# EAGLE design prox_module (EAGLE 6.3)
Proximity Module -- manages data from 8 external bumpers and 3 ultrasonic sensors. All bumper inputs are sent through a low-pass filter (0.1uF cap) and a schmitt trigger/inverter to smooth the signals. This module is a 5V system that uses a custom level converter for the SDA and SCL lines to make the 5V system work with the 3.3V systems. The ultrasonic sensors are connected directly to a digital pin. All power in this system is smoothed for low-pass and high-pass noise.
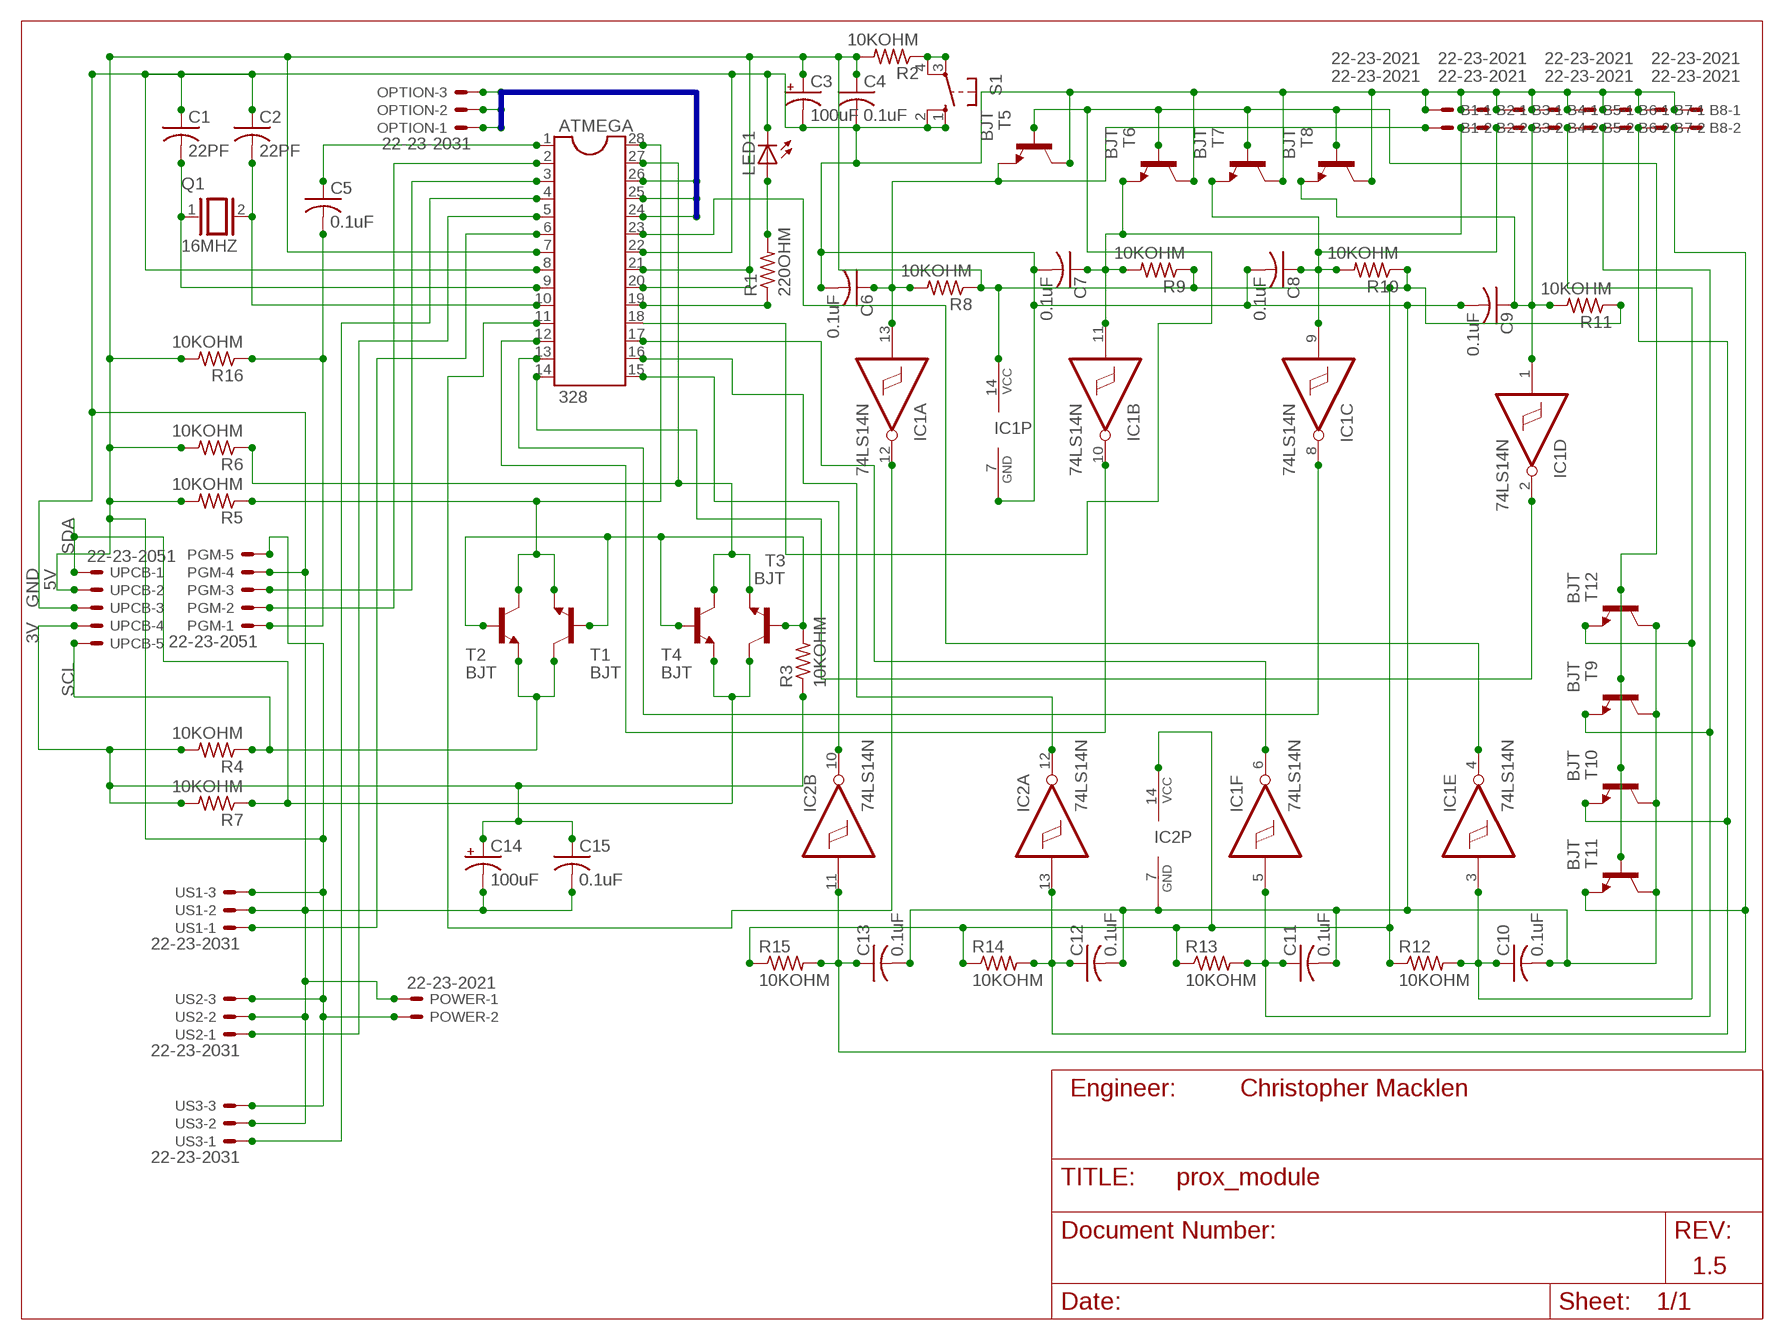
[diagram p0: schematic, sheet 1]

## Parts
ATMEGA  328  DIL28  [DIL28-6]
B1  22-23-2021  [22-23-2021]
B2  22-23-2021  [22-23-2021]
B3  22-23-2021  [22-23-2021]
B4  22-23-2021  [22-23-2021]
B5  22-23-2021  [22-23-2021]
B6  22-23-2021  [22-23-2021]
B7  22-23-2021  [22-23-2021]
B8  22-23-2021  [22-23-2021]
C1  22PF  C-US025-024X044  [C025-024X044]
C2  22PF  C-US025-024X044  [C025-024X044]
C3  100uF  CPOL-USE2-5  [E2-5]
C4  0.1uF  C-US025-024X044  [C025-024X044]
C5  0.1uF  C-US025-024X044  [C025-024X044]
C6  0.1uF  C-US025-024X044  [C025-024X044]
C7  0.1uF  C-US025-024X044  [C025-024X044]
C8  0.1uF  C-US025-024X044  [C025-024X044]
C9  0.1uF  C-US025-024X044  [C025-024X044]
C10  0.1uF  C-US025-024X044  [C025-024X044]
C11  0.1uF  C-US025-024X044  [C025-024X044]
C12  0.1uF  C-US025-024X044  [C025-024X044]
C13  0.1uF  C-US025-024X044  [C025-024X044]
C14  100uF  CPOL-USE2-5  [E2-5]
C15  0.1uF  C-US025-024X044  [C025-024X044]
IC1  74LS14N  [DIL14]
IC2  74LS14N  [DIL14]
LED1  LED3MM  [LED3MM]
OPTION  22-23-2031  [22-23-2031]
PGM  22-23-2051  [22-23-2051]
POWER  22-23-2021  [22-23-2021]
Q1  16MHZ  XTAL/S  [QS]
R1  220OHM  R-US_0204/7  [0204/7]
R2  10KOHM  R-US_0204/7  [0204/7]
R3  10KOHM  R-US_0204/7  [0204/7]
R4  10KOHM  R-US_0204/7  [0204/7]
R5  10KOHM  R-US_0204/7  [0204/7]
R6  10KOHM  R-US_0204/7  [0204/7]
R7  10KOHM  R-US_0204/7  [0204/7]
R8  10KOHM  R-US_0204/7  [0204/7]
R9  10KOHM  R-US_0204/7  [0204/7]
R10  10KOHM  R-US_0204/7  [0204/7]
R11  10KOHM  R-US_0204/7  [0204/7]
R12  10KOHM  R-US_0204/7  [0204/7]
R13  10KOHM  R-US_0204/7  [0204/7]
R14  10KOHM  R-US_0204/7  [0204/7]
R15  10KOHM  R-US_0204/7  [0204/7]
R16  10KOHM  R-US_0204/7  [0204/7]
S1  10-XX  [B3F-10XX]
T1  BJT  -NPN-TO92-E1  [TO92-E1]
T2  BJT  -NPN-TO92-E1  [TO92-E1]
T3  BJT  -NPN-TO92-E1  [TO92-E1]
T4  BJT  -NPN-TO92-E1  [TO92-E1]
T5  BJT  -NPN-TO92-E1  [TO92-E1]
T6  BJT  -NPN-TO92-E1  [TO92-E1]
T7  BJT  -NPN-TO92-E1  [TO92-E1]
T8  BJT  -NPN-TO92-E1  [TO92-E1]
T9  BJT  -NPN-TO92-E1  [TO92-E1]
T10  BJT  -NPN-TO92-E1  [TO92-E1]
T11  BJT  -NPN-TO92-E1  [TO92-E1]
T12  BJT  -NPN-TO92-E1  [TO92-E1]
UPCB  22-23-2051  [22-23-2051]
US1  22-23-2031  [22-23-2031]
US2  22-23-2031  [22-23-2031]
US3  22-23-2031  [22-23-2031]

## Nets
3V: C14.+ C15.1 R3.1 R4.2 R7.2 UPCB.4
5V: ATMEGA.7 ATMEGA.20 ATMEGA.21 C3.+ C4.1 IC1.14(P:VCC) IC2.14(P:VCC) PGM.5 POWER.2 R2.2 R5.2 R6.2 R8.1 R9.1 R10.1 R11.1 R12.1 R13.1 R14.1 R15.1 R16.2 UPCB.2 US1.3 US2.3 US3.3
BMP-IN1: B1.2 C6.1 IC1.13(A:I) R8.2 T5.3(E)
BMP-IN2: B2.2 C7.1 IC1.11(B:I) R9.2 T6.3(E)
BMP-IN3: B3.2 C8.1 IC1.9(C:I) R10.2 T7.3(E)
BMP-IN4: B4.2 C9.1 IC1.1(D:I) R11.2 T8.3(E)
BMP-IN5: B5.2 C10.1 IC1.3(E:I) R12.2 T12.3(E)
BMP-IN6: B6.2 C11.1 IC1.5(F:I) R13.2 T9.3(E)
BMP-IN7: B7.2 C12.1 IC2.13(A:I) R14.2 T10.3(E)
BMP-IN8: B8.2 C13.1 IC2.11(B:I) R15.2 T11.3(E)
BMP-OUT1: ATMEGA.11 IC1.12(A:O)
BMP-OUT2: ATMEGA.12 IC1.10(B:O)
BMP-OUT3: ATMEGA.13 IC1.8(C:O)
BMP-OUT4: ATMEGA.14 IC1.2(D:O)
BMP-OUT5: ATMEGA.15 IC2.10(B:O)
BMP-OUT6: ATMEGA.16 IC2.12(A:O)
BMP-OUT7: ATMEGA.17 IC1.6(F:O)
BMP-OUT8: ATMEGA.23 IC1.4(E:O)
CLK-1: ATMEGA.9 C1.2 Q1.1
CLK-2: ATMEGA.10 C2.2 Q1.2
GND: ATMEGA.8 ATMEGA.22 B1.1 B2.1 B3.1 B4.1 B5.1 B6.1 B7.1 B8.1 C1.1 C2.1 C3.- C4.2 C6.2 C7.2 C8.2 C9.2 C10.2 C11.2 C12.2 C13.2 C14.- C15.2 IC1.7(P:GND) IC2.7(P:GND) LED1.K(C) PGM.4 POWER.1 S1.1(S) S1.2(S1) T5.1(C) T6.1(C) T7.1(C) T8.1(C) T9.1(C) T10.1(C) T11.1(C) T12.1(C) UPCB.3 US1.2 US2.2 US3.2
I2C-EN: R3.2 T1.2(B) T2.2(B) T3.2(B) T4.2(B)
LEDNET-1: ATMEGA.19 R1.1
LEDNET-2: LED1.A R1.2
OPTION1: ATMEGA.24 OPTION.1
OPTION2: ATMEGA.25 OPTION.2
OPTION3: ATMEGA.26 OPTION.3
RST-1: C5.2 PGM.1 R16.1
RST-2: ATMEGA.1 C5.1
RST-SW: R2.1 S1.3(P) S1.4(P1)
RX-TX: ATMEGA.3 PGM.3
SCL: R4.1 T1.1(C) T2.3(E) UPCB.5
SCL-5V: ATMEGA.28 R5.1 T1.3(E) T2.1(C)
SDA: R7.1 T3.1(C) T4.3(E) UPCB.1
SDA-5V: ATMEGA.27 R6.1 T3.3(E) T4.1(C)
TEST: ATMEGA.18 T5.2(B) T6.2(B) T7.2(B) T8.2(B) T9.2(B) T10.2(B) T11.2(B) T12.2(B)
TX-RX: ATMEGA.2 PGM.2
US1DATA: ATMEGA.6 US1.1
US2DATA: ATMEGA.5 US2.1
US3DATA: ATMEGA.4 US3.1
Unconnected: IC2.1(D:I) IC2.2(D:O) IC2.3(E:I) IC2.4(E:O) IC2.5(F:I) IC2.6(F:O) IC2.8(C:O) IC2.9(C:I)

## Buses
OPTION[1..3]

## Notes on the sheet
- Engineer: | Christopher Macklen
- 1.5

## Library data of the parts
ATMEGA = ic-package:DIL28: Dual In Line
B1-B8 POWER = con-molex:22-23-2021: .100" (2.54mm) Center Header - 2 Pin; MF: MOLEX; MPN: 22-23-2021; OC_FARNELL: 1462926; OC_NEWARK: 25C3832
C1 C2 C4-C13 C15 = rcl:C-US: CAPACITOR, American symbol
C3 C14 = rcl:CPOL-US: POLARIZED CAPACITOR, American symbol
IC1 IC2 = 74xx-us:74*14: Hex schmitt trigger INVERTER
LED1 = led:LED: LED OSRAM: - CHIPLED LG R971, LG N971, LY N971, LG Q971, LY Q971, LO R971, LY R971 LH N974, LH R974 LS Q976, LO Q976, LY Q976 LO Q996 - Hyper CHIPLED LW Q18S LB Q993, LB Q99A, LB R99A - SideLED LS A670, LO A670, LY A670, LG A670, LP A670 LB A673, LV A673, LT A673, LW A673 LH A674 LY A675 LS A676, LA A676, LO A676, LY A676, LW A676 LS A679, LY A679, LG A679 - Hyper Micro SIDELED® LS Y876, LA Y876, LO Y876, LY Y876 LT Y87S - SmartLED LW L88C, LW L88S LB L89C, LB L89S, LG L890 LS L89K, LO L89K, LY L89K LS L896, LA L896, LO L896, LY L896 - TOPLED LS T670, LO T670, LY T670, LG T670, LP T670 LSG T670, LSP T670, LSY T670, LOP T670, LYG T670 LG T671, LOG T671, LSG T671 LB T673, LV T673, LT T673, LW T673 LH T674 LS T676, LA T676, LO T676, LY T676, LB T676, LH T676, LSB T676, LW T676 LB T67C, LV T67C, LT T67C, LS T67K, LO T67K, LY T67K, LW E67C LS E67B, LA E67B, LO E67B, LY E67B, LB E67C, LV E67C, LT E67C LW T67C LS T679, LY T679, LG T679 LS T770, LO T770, LY T770, LG T770, LP T770 LB T773, LV T773, LT T773, LW T773 LH T774 LS E675, LA E675, LY E675, LS T675 LS T776, LA T776, LO T776, LY T776, LB T776 LHGB T686 LT T68C, LB T68C - Hyper Mini TOPLED® LB M676 - Mini TOPLED Santana® LG M470 LS M47K, LO M47K, LY M47K Source: http://www.osram.convergy.de LUXEON: - LUMILED® LXK2-PW12-R00, LXK2-PW12-S00, LXK2-PW14-U00, LXK2-PW14-V00 LXK2-PM12-R00, LXK2-PM12-S00, LXK2-PM14-U00 LXK2-PE12-Q00, LXK2-PE12-R00, LXK2-PE12-S00, LXK2-PE14-T00, LXK2-PE14-U00 LXK2-PB12-K00, LXK2-PB12-L00, LXK2-PB12-M00, LXK2-PB14-N00, LXK2-PB14-P00, LXK2-PB14-Q00 LXK2-PR12-L00, LXK2-PR12-M00, LXK2-PR14-Q00, LXK2-PR14-R00 LXK2-PD12-Q00, LXK2-PD12-R00, LXK2-PD12-S00 LXK2-PH12-R00, LXK2-PH12-S00 LXK2-PL12-P00, LXK2-PL12-Q00, LXK2-PL12-R00 Source: www.luxeon.com KINGBRIGHT: KA-3528ASYC Source: www.kingbright.com
OPTION US1-US3 = con-molex:22-23-2031: .100" (2.54mm) Center Header - 3 Pin; MF: MOLEX; MPN: 22-23-2031; OC_FARNELL: 1462950; OC_NEWARK: 30C0862
PGM UPCB = con-molex:22-23-2051: .100" (2.54mm) Center Header - 5 Pin; MF: MOLEX; MPN: 22-23-2051; OC_FARNELL: 1462952; OC_NEWARK: 38C9178
Q1 = special:XTAL/S: CRYSTAL
R1-R16 = rcl:R-US_: RESISTOR, American symbol
S1 = switch-omron:10-XX: OMRON SWITCH; MPN: B3F-1000; OC_FARNELL: 176432; OC_NEWARK: 36M3542
T1-T12 = transistor:*-NPN-: NPN Transistror BF959 corrected 2008.03.06

## Board
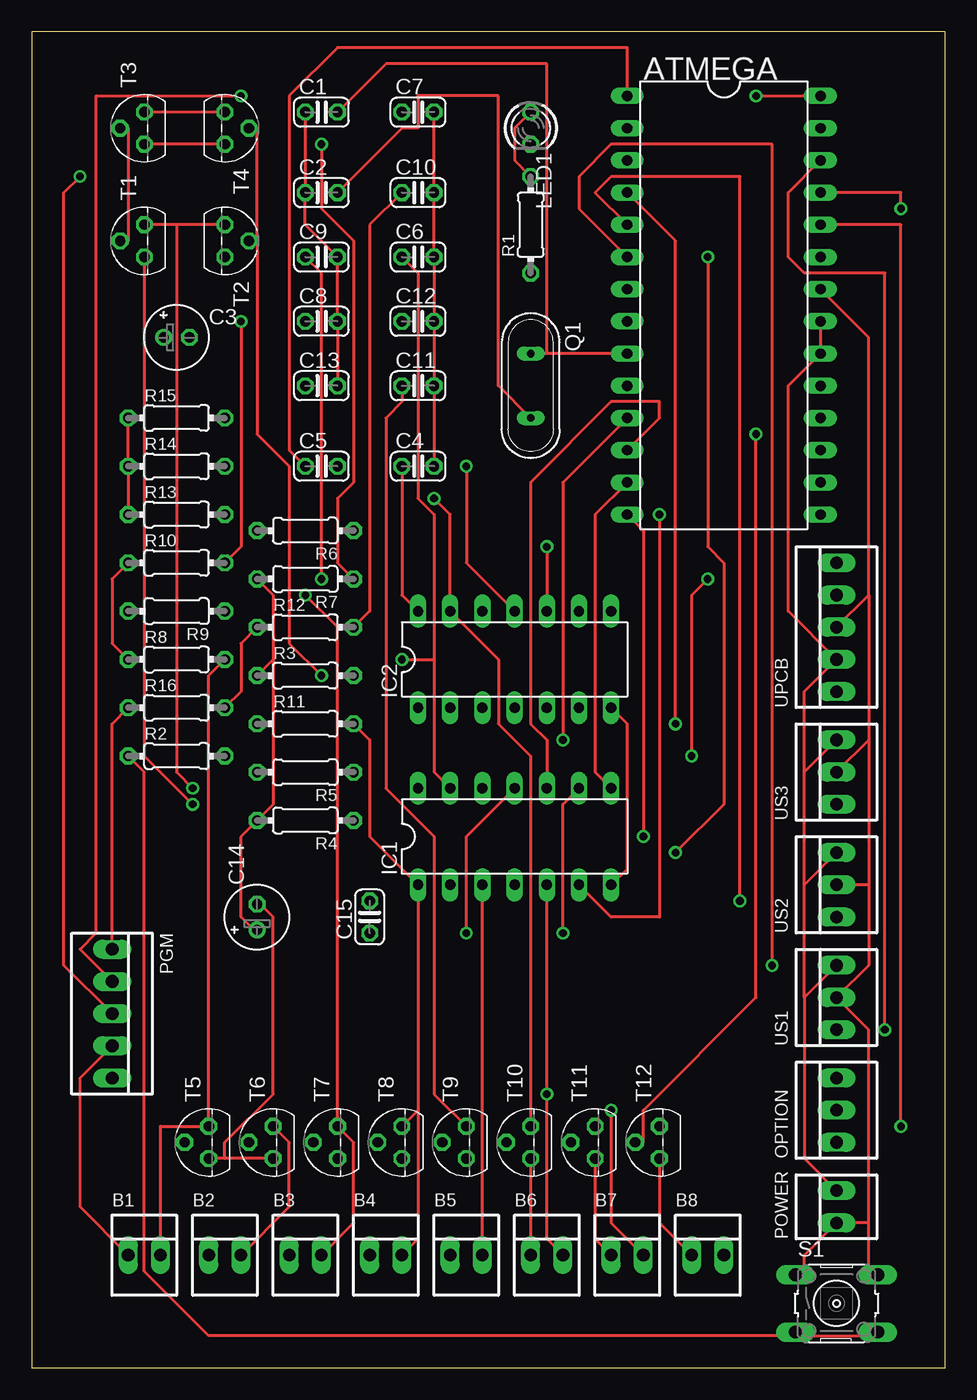
[diagram p1: board, top side]
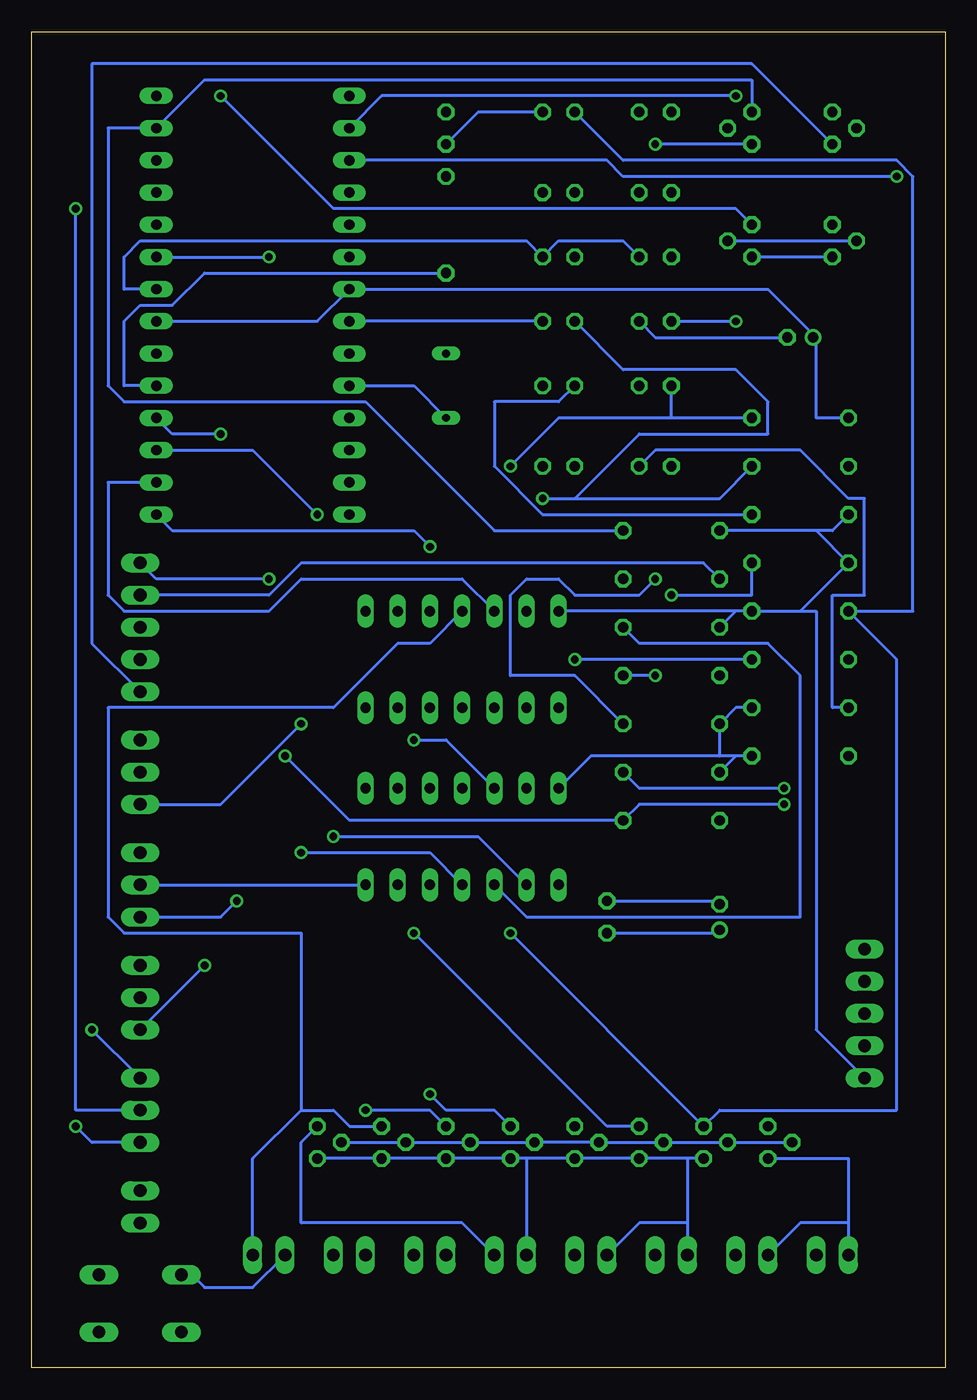
[diagram p2: board, bottom side, seen from below]

Size 72.06 x 105.4 mm. Coordinates in mm from the lower left corner, seen from the top.
Outline: 0,0 72.06,0 72.06,105.4 0,105.4 0,0
Copper layers (1*16): Top 0.035mm / dielectric 1.5mm / Bottom 0.035mm
Design rules "default": minimum track width 10mil, minimum drill 24mil, track to track 8mil, track to pad 8mil, pad to pad 8mil, via to via 8mil, smd to smd 8mil, copper to edge 40mil, drill to drill 8mil, minimum pad ring 10mil, minimum via ring 8mil, stop-mask expansion 4mil, vias tented up to drill 0mil, thermal gap 10mil

### Footprints (pad centres in the part's own frame; a part is rotated, then mirrored left to right if it is on the bottom)
DIL28-6 = drill 0.813 long: 1 -16.51,-7.62; 2 -13.97,-7.62; 3 -11.43,-7.62; 4 -8.89,-7.62; 5 -6.35,-7.62; 6 -3.81,-7.62; 7 -1.27,-7.62; 8 1.27,-7.62; 9 3.81,-7.62; 10 6.35,-7.62; 11 8.89,-7.62; 12 11.43,-7.62; 13 13.97,-7.62; 14 16.51,-7.62; 15 16.51,7.62; 16 13.97,7.62; 17 11.43,7.62; 18 8.89,7.62; 19 6.35,7.62; 20 3.81,7.62; 21 1.27,7.62; 22 -1.27,7.62; 23 -3.81,7.62; 24 -6.35,7.62; 25 -8.89,7.62; 26 -11.43,7.62; 27 -13.97,7.62; 28 -16.51,7.62
22-23-2021 = drill 1 long: 1 -1.27,0; 2 1.27,0
C025-024X044 = drill 0.813 octagon: 1 -1.27,0; 2 1.27,0
E2-5 = drill 0.813 pad 1.27: + -1.016,0 | drill 0.813 pad 1.27 octagon: - 1.016,0
DIL14 = drill 0.813 long: 1 -7.62,-3.81; 2 -5.08,-3.81; 3 -2.54,-3.81; 4 0,-3.81; 5 2.54,-3.81; 6 5.08,-3.81; 7 7.62,-3.81; 8 7.62,3.81; 9 5.08,3.81; 10 2.54,3.81; 11 0,3.81; 12 -2.54,3.81; 13 -5.08,3.81; 14 -7.62,3.81
LED3MM = drill 0.813 octagon: A -1.27,0; K 1.27,0
22-23-2031 = drill 1 long: 1 -2.54,0; 2 0,0; 3 2.54,0
22-23-2051 = drill 1 long: 1 -5.08,0; 2 -2.54,0; 3 0,0; 4 2.54,0; 5 5.08,0
QS = drill 0.61 long: 1 -2.54,0; 2 2.54,0
0204/7 = drill 0.813 octagon: 1 -3.81,0; 2 3.81,0
B3F-10XX = drill 1.016 long: 1 -3.251,2.261; 2 3.251,2.261; 3 -3.251,-2.261; 4 3.251,-2.261
TO92-E1 = drill 0.813 octagon: 1 -1.27,0; 2 0,1.905; 3 1.27,0

### Placement (x,y rotation side)
ATMEGA  54.61,83.82 270 top
B1  8.89,8.89 0 top
B2  15.24,8.89 0 top
B3  21.59,8.89 0 top
B4  27.94,8.89 0 top
B5  34.29,8.89 0 top
B6  40.64,8.89 0 top
B7  46.99,8.89 0 top
B8  53.34,8.89 0 top
C1  22.86,99.06 0 top
C2  22.86,92.71 0 top
C3  11.43,81.28 0 top
C4  30.48,71.12 0 top
C5  22.86,71.12 0 top
C6  30.48,87.63 0 top
C7  30.48,99.06 0 top
C8  22.86,82.55 0 top
C9  22.86,87.63 0 top
C10  30.48,92.71 0 top
C11  30.48,77.47 0 top
C12  30.48,82.55 0 top
C13  22.86,77.47 0 top
C14  17.78,35.56 90 top
C15  26.67,35.56 90 top
IC1  38.1,41.91 0 top
IC2  38.1,55.88 0 top
LED1  39.37,97.79 270 top
OPTION  63.5,20.32 90 top
PGM  6.35,27.94 270 top
POWER  63.5,12.7 90 top
Q1  39.37,77.47 270 top
R1  39.37,90.17 90 top
R2  11.43,48.26 0 top
R3  21.59,54.61 0 top
R4  21.59,43.18 180 top
R5  21.59,46.99 180 top
R6  21.59,66.04 180 top
R7  21.59,62.23 180 top
R8  11.43,55.88 0 top
R9  11.43,59.69 180 top
R10  11.43,63.5 0 top
R11  21.59,50.8 0 top
R12  21.59,58.42 0 top
R13  11.43,67.31 0 top
R14  11.43,71.12 0 top
R15  11.43,74.93 0 top
R16  11.43,52.07 0 top
S1  63.5,5.08 0 top
T1  8.89,88.9 90 top
T2  15.24,88.9 270 top
T3  8.89,97.79 90 top
T4  15.24,97.79 270 top
T5  13.97,17.78 90 top
T6  19.05,17.78 90 top
T7  24.13,17.78 90 top
T8  29.21,17.78 90 top
T9  34.29,17.78 90 top
T10  39.37,17.78 90 top
T11  44.45,17.78 90 top
T12  49.53,17.78 90 top
UPCB  63.5,58.42 90 top
US1  63.5,29.21 90 top
US2  63.5,38.1 90 top
US3  63.5,46.99 90 top

### Tracks (layer width: path | path; a pad name or v marks a point on that pad's centre or on a via)
3V
  Top 0.254: C14.+ 17.78,34.29 16.51,35.56 16.51,41.91 R4.2 19.05,44.45 19.05,55.88 | 19.05,55.88 R3.1 | 19.05,55.88 19.05,60.96 R7.2
  Bottom 0.254: C15.1 17.78,34.29 C14.+ | UPCB.4 53.34,60.96 50.8,63.5 19.05,63.5 R7.2
5V
  Top 0.254: R8.1 6.35,57.15 6.35,62.23 R10.1 | R13.1 R14.1 R15.1 | IC2.14 29.21,60.96 C4.1 | R16.2 16.51,53.34 16.51,57.15 R12.1 | ATMEGA.21 ATMEGA.20 59.69,77.47 59.69,59.69 UPCB.2 60.96,53.34 60.96,46.99 | POWER.2 60.96,16.51 60.96,29.21 | US1.3 60.96,29.21 | 60.96,38.1 US2.3 | 60.96,29.21 60.96,38.1 | 60.96,46.99 US3.3 | 60.96,38.1 60.96,46.99
  Bottom 0.254: 10.16,66.04 8.89,66.04 R13.1 | 10.16,66.04 R6.2 | 10.16,81.28 10.16,74.93 R15.1 | 10.16,66.04 R10.1 11.43,59.69 | R16.2 16.51,52.07 R11.1 17.78,48.26 | 16.51,48.26 R5.2 | R2.2 16.51,48.26 | IC1.14 27.94,48.26 17.78,48.26 | 16.51,48.26 17.78,48.26 | 16.51,59.69 R12.1 | 16.51,59.69 R9.1 11.43,59.69 | PGM.5 10.16,26.67 10.16,59.69 11.43,59.69 | 16.51,59.69 IC2.14 | ATMEGA.21 49.53,82.55 ATMEGA.7 13.97,85.09 10.16,81.28 | 10.16,81.28 C3.+
BMP-IN1  (via drill 0.61)
  Top 0.254: IC1.13 31.75,46.99 31.75,55.88 | 31.75,55.88 31.75,67.31 30.48,68.58 30.48,86.36 C6.1 | B1.2 10.16,19.05 T5.3 13.97,54.61 R8.2 | v29.21,55.88 31.75,55.88
  Bottom 0.254: R8.2 v29.21,55.88
BMP-IN2  (via drill 0.61)
  Top 0.254: T6.3 20.32,17.78 20.32,12.7 B2.2 | IC1.11 34.29,41.91 v34.29,34.29
  Bottom 0.254: v34.29,34.29 T6.3 17.78,20.32 3.81,20.32 3.81,55.88 R9.2 2.54,59.69 2.54,93.98 3.81,95.25 25.4,95.25 C7.1
BMP-IN3  (via drill 0.61)
  Top 0.254: R10.2 16.51,64.77 v16.51,82.55 | B3.2 25.4,11.43 25.4,17.78 T7.3 24.13,58.42 v21.59,60.96 | IC1.9 41.91,44.45 v41.91,34.29
  Bottom 0.254: C8.1 v16.51,82.55 | v41.91,34.29 26.67,19.05 T7.3 | R10.2 15.24,60.96 v21.59,60.96
BMP-IN4  (via drill 0.61)
  Top 0.254: 30.48,20.32 T8.3 | 30.48,20.32 IC1.1 26.67,41.91 26.67,49.53 R11.2 | B4.2 30.48,10.16 30.48,20.32 | C9.1 22.86,86.36 v22.86,62.23
  Bottom 0.254: v22.86,62.23 24.13,60.96 29.21,60.96 30.48,62.23 33.02,62.23 34.29,60.96 34.29,54.61 29.21,54.61 R11.2
BMP-IN5
  Top 0.254: R12.2 26.67,59.69 26.67,90.17 C10.1 | B5.2 IC1.3
  Bottom 0.254: T12.3 50.8,17.78 50.8,11.43 38.1,11.43 B5.2 | R12.2 24.13,57.15 13.97,57.15 11.43,54.61 11.43,35.56 33.02,35.56 IC1.3
BMP-IN6  (via drill 0.61)
  Top 0.254: IC1.5 v40.64,21.59 40.64,10.16 B6.2 | T9.3 31.75,21.59 31.75,41.91 27.94,45.72 27.94,74.93 29.21,76.2 C11.1
  Bottom 0.254: R13.2 31.75,67.31 35.56,71.12 35.56,76.2 30.48,76.2 C11.1 | v40.64,21.59 39.37,20.32 35.56,20.32 T9.3
BMP-IN7  (via drill 0.61)
  Top 0.254: T10.3 39.37,48.26 36.83,50.8 36.83,55.88 IC2.13 33.02,67.31 v31.75,68.58 | B7.2 45.72,11.43 v45.72,20.32
  Bottom 0.254: R14.2 17.78,68.58 29.21,68.58 | v31.75,68.58 29.21,68.58 | C12.1 25.4,78.74 16.51,78.74 13.97,76.2 13.97,73.66 24.13,73.66 29.21,68.58 | v45.72,20.32 40.64,20.32 T10.3
BMP-IN8  (via drill 0.61)
  Top 0.254: IC2.11 34.29,63.5 v34.29,71.12
  Bottom 0.254: T11.3 46.99,19.05 48.26,20.32 50.8,20.32 | 50.8,20.32 54.61,16.51 B8.2 | v34.29,71.12 30.48,74.93 21.59,74.93 | R15.2 21.59,74.93 | 21.59,74.93 C13.1 | 50.8,20.32 50.8,34.29 64.77,34.29 66.04,35.56 66.04,52.07 48.26,52.07 43.18,57.15 40.64,57.15 IC2.11
BMP-OUT1  (via drill 0.61)
  Top 0.254: v41.91,49.53 41.91,69.85 ATMEGA.11
  Bottom 0.254: IC1.12 39.37,49.53 v41.91,49.53
BMP-OUT2
  Top 0.254: IC1.10 40.64,49.53 39.37,50.8 39.37,69.85 45.72,76.2 49.53,76.2 49.53,74.93 ATMEGA.12
BMP-OUT3
  Top 0.254: IC1.8 44.45,46.99 44.45,67.31 ATMEGA.13
BMP-OUT4  (via drill 0.61)
  Top 0.254: v48.26,41.91 48.26,66.04 ATMEGA.14
  Bottom 0.254: IC1.2 36.83,41.91 v48.26,41.91
BMP-OUT5  (via drill 0.61)
  Top 0.254: v40.64,64.77 IC2.10
  Bottom 0.254: v40.64,64.77 41.91,66.04 60.96,66.04 ATMEGA.15
BMP-OUT6
  Bottom 0.254: IC2.12 38.1,62.23 50.8,62.23 53.34,59.69 64.77,59.69 66.04,60.96 66.04,69.85 ATMEGA.16
BMP-OUT7  (via drill 0.61)
  Top 0.254: IC1.6 45.72,35.56 49.53,35.56 v49.53,67.31
  Bottom 0.254: v49.53,67.31 54.61,72.39 ATMEGA.17
BMP-OUT8  (via drill 0.61)
  Top 0.254: v50.8,40.64 54.61,44.45 54.61,63.5 53.34,64.77 v53.34,87.63
  Bottom 0.254: IC1.4 40.64,40.64 v50.8,40.64 | ATMEGA.23 v53.34,87.63
CLK-1
  Top 0.254: ATMEGA.9 40.64,80.01 | 40.64,80.01 Q1.1 | C1.2 27.94,102.87 40.64,102.87 40.64,80.01
CLK-2
  Top 0.254: C2.2 29.21,97.79 30.48,97.79 30.48,100.33 36.83,100.33 36.83,77.47 Q1.2
  Bottom 0.254: Q1.2 41.91,77.47 ATMEGA.10
GND
  Top 0.254: T6.1 15.24,16.51 | 15.24,16.51 T5.1 | T10.1 B6.1 | B7.1 44.45,10.16 T11.1 | B8.1 49.53,11.43 T12.1 | PGM.4 3.81,22.86 3.81,12.7 B1.1 | 15.24,16.51 15.24,17.78 19.05,21.59 19.05,35.56 17.78,36.83 C14.- | C1.1 C2.1 21.59,90.17 C9.2 C8.2 C13.2 | C4.2 C11.2 C12.2 C6.2 C10.2 C7.2 | IC2.7 46.99,50.8 46.99,39.37 IC1.7 | S1.1 60.96,7.62 60.96,8.89 POWER.1 66.04,11.43 | 66.04,11.43 66.04,7.62 S1.2 | 66.04,11.43 66.04,26.67 US1.2 66.04,31.75 66.04,38.1 | ATMEGA.22 66.04,81.28 66.04,60.96 | UPCB.3 66.04,60.96 | 66.04,49.53 US3.2 | 66.04,60.96 66.04,49.53 | 66.04,49.53 66.04,38.1 | 66.04,38.1 US2.2
  Bottom 0.254: C15.2 17.78,36.83 C14.- | T6.1 20.32,16.51 | 20.32,16.51 T7.1 T8.1 33.02,16.51 | 33.02,16.51 T9.1 T10.1 T11.1 T12.1 | 7.62,11.43 7.62,16.51 T5.1 | 7.62,11.43 B1.1 | B2.1 11.43,11.43 7.62,11.43 | 20.32,16.51 20.32,11.43 | 20.32,11.43 B3.1 | B4.1 24.13,11.43 20.32,11.43 | 33.02,16.51 B5.1 | C3.- 22.86,81.28 C8.2 | C12.2 ATMEGA.8 | LED1.K 36.83,99.06 C7.2 | C9.2 25.4,88.9 30.48,88.9 C6.2 33.02,88.9 63.5,88.9 64.77,87.63 64.77,85.09 ATMEGA.22 | US2.2 IC1.7 | B8.1 54.61,6.35 58.42,6.35 59.69,7.62 S1.1
I2C-EN  (via drill 0.61)
  Top 0.254: T1.2 7.62,88.9 7.62,97.79 T3.2 | v22.86,54.61 20.32,57.15 20.32,71.12 17.78,73.66 17.78,88.9 | 17.78,88.9 17.78,97.79 T4.2 | 17.78,88.9 T2.2
  Bottom 0.254: v22.86,54.61 R3.2 | T2.2 T1.2
LEDNET-1
  Bottom 0.254: R1.1 58.42,86.36 60.96,83.82 63.5,83.82 64.77,82.55 64.77,77.47 ATMEGA.19
LEDNET-2
  Top 0.254: R1.2 38.1,95.25 38.1,97.79 LED1.A
OPTION1  (via drill 0.61)
  Top 0.254: ATMEGA.24 68.58,90.17 v68.58,19.05
  Bottom 0.254: v68.58,19.05 67.31,17.78 OPTION.1
OPTION2  (via drill 0.61)
  Top 0.254: ATMEGA.25 68.58,92.71 v68.58,91.44
  Bottom 0.254: v68.58,91.44 68.58,20.32 OPTION.2
OPTION3  (via drill 0.61)
  Top 0.254: ATMEGA.26 59.69,92.71 59.69,87.63 60.96,86.36 67.31,86.36 v67.31,26.67
  Bottom 0.254: OPTION.3 v67.31,26.67
RST-1
  Top 0.254: R16.1 6.35,50.8 PGM.1
  Bottom 0.254: C5.2 22.86,72.39 11.43,72.39 7.62,68.58 6.35,68.58 6.35,60.96 8.89,60.96 8.89,52.07 R16.1
RST-2
  Top 0.254: C5.1 20.32,72.39 20.32,100.33 24.13,104.14 46.99,104.14 ATMEGA.1
RST-SW
  Top 0.254: R2.1 8.89,46.99 8.89,7.62 13.97,2.54 59.69,2.54 S1.3 60.96,2.54 66.04,2.54 S1.4
RX-TX  (via drill 0.61)
  Top 0.254: v3.81,93.98 2.54,92.71 2.54,31.75 PGM.3
  Bottom 0.254: ATMEGA.3 26.67,95.25 25.4,93.98 v3.81,93.98
SCL  (via drill 0.61)
  Top 0.254: v12.7,44.45 8.89,48.26 T1.1 | v53.34,62.23 52.07,60.96 v52.07,48.26
  Bottom 0.254: v12.7,44.45 24.13,44.45 R4.1 46.99,43.18 v52.07,48.26 | T1.1 T2.3 | UPCB.5 62.23,62.23 v53.34,62.23
SCL-5V  (via drill 0.61)
  Top 0.254: T2.1 11.43,90.17 | 11.43,90.17 T1.3 | v12.7,45.72 11.43,46.99 11.43,90.17 | v57.15,100.33 ATMEGA.28
  Bottom 0.254: R5.1 24.13,45.72 v12.7,45.72 | v57.15,100.33 48.26,91.44 16.51,91.44 T2.1
SDA  (via drill 0.61)
  Top 0.254: T4.3 T3.1 | R7.1 24.13,63.5 24.13,68.58 25.4,69.85 25.4,88.9 22.86,91.44 v22.86,96.52
  Bottom 0.254: T4.3 v22.86,96.52 | UPCB.1 67.31,57.15 67.31,102.87 15.24,102.87 T3.1
SDA-5V
  Top 0.254: T4.1 T3.3
  Bottom 0.254: R6.1 35.56,66.04 45.72,76.2 64.77,76.2 66.04,77.47 66.04,97.79 ATMEGA.27 58.42,101.6 15.24,101.6 T4.1
TEST  (via drill 0.61)
  Top 0.254: v57.15,73.66 57.15,29.21 48.26,20.32 48.26,17.78 T12.2
  Bottom 0.254: T5.2 T6.2 T7.2 T8.2 T9.2 T10.2 T11.2 T12.2 | ATMEGA.18 60.96,73.66 v57.15,73.66
TX-RX  (via drill 0.61)
  Top 0.254: v16.51,100.33 5.08,100.33 5.08,34.29 3.81,33.02 PGM.2
  Bottom 0.254: ATMEGA.2 44.45,100.33 v16.51,100.33
US1DATA  (via drill 0.61)
  Top 0.254: ATMEGA.6 43.18,91.44 43.18,93.98 45.72,96.52 58.42,96.52 v58.42,31.75
  Bottom 0.254: US1.1 v58.42,31.75
US2DATA  (via drill 0.61)
  Top 0.254: ATMEGA.5 44.45,92.71 45.72,93.98 55.88,93.98 v55.88,36.83
  Bottom 0.254: v55.88,36.83 57.15,35.56 US2.1
US3DATA  (via drill 0.61)
  Top 0.254: ATMEGA.4 50.8,88.9 v50.8,50.8
  Bottom 0.254: v50.8,50.8 57.15,44.45 US3.1